# EAGLE design PCE_Trace_Power_test (EAGLE 9.6.2)
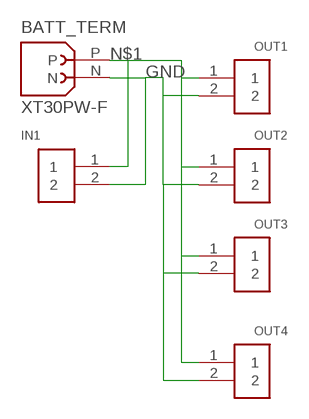
[diagram p0: schematic, sheet 1]

## Parts
BATT_TERM  XT30PW-F  [AMASS_XT30PW-F]
IN1  282837-2  [TE_282837-2]
OUT1  282837-2  [TE_282837-2]
OUT2  282837-2  [TE_282837-2]
OUT3  282837-2  [TE_282837-2]
OUT4  282837-2  [TE_282837-2]

## Nets
GND: BATT_TERM.N IN1.2 OUT1.2 OUT2.2 OUT3.2 OUT4.2
N$1: BATT_TERM.P IN1.1 OUT1.1 OUT2.1 OUT3.1 OUT4.1

## Library data of the parts
BATT_TERM = XT30PW-F:XT30PW-F: Check availability <https://pricing.snapeda.com/parts/XT30PW-F/amass/view-part?ref=eda>; AVAILABILITY: Not in stock; CHECK_PRICES: https://www.snapeda.com/parts/XT30PW-F/AMASS/view-part/?ref=eda; DESCRIPTION: Socket; DC supply; XT30; female; PIN: 2; on PCBs; THT; yellow; 15A; MF: amass; MP: XT30PW-F; PACKAGE: None; PRICE: None; SNAPEDA_LINK: https://www.snapeda.com/parts/XT30PW-F/AMASS/view-part/?ref=snap
IN1 OUT1-OUT4 = 282837-2:282837-2: TERM BLOCK 5.08MM 2POS SIDE ENTY Check availability <https://pricing.snapeda.com/parts/282837-2/TE%20Connectivity/view-part?ref=eda>; AVAILABILITY: In Stock; CHECK_PRICES: https://www.snapeda.com/parts/282837-2/TE+Connectivity+AMP+Connectors/view-part/?ref=eda; COMMENT: 282837-2; DESCRIPTION: Terminal Block Connector Wire Receptacle 2 5.08 mm 30-16 AWG Green 13.5 A 250 V | TE Connectivity 282837-2; MF: TE Connectivity; MP: 282837-2; PACKAGE: None; PRICE: None; PURCHASE-URL: https://www.snapeda.com/api/url_track_click_mouser/?unipart_id=2549980&manufacturer=TE Connectivity&part_name=282837-2&search_term=None; SNAPEDA_LINK: https://www.snapeda.com/parts/282837-2/TE+Connectivity+AMP+Connectors/view-part/?ref=snap

## Net classes
2 lowpower: width 0.254 mm, drill 0.483 mm

## Board
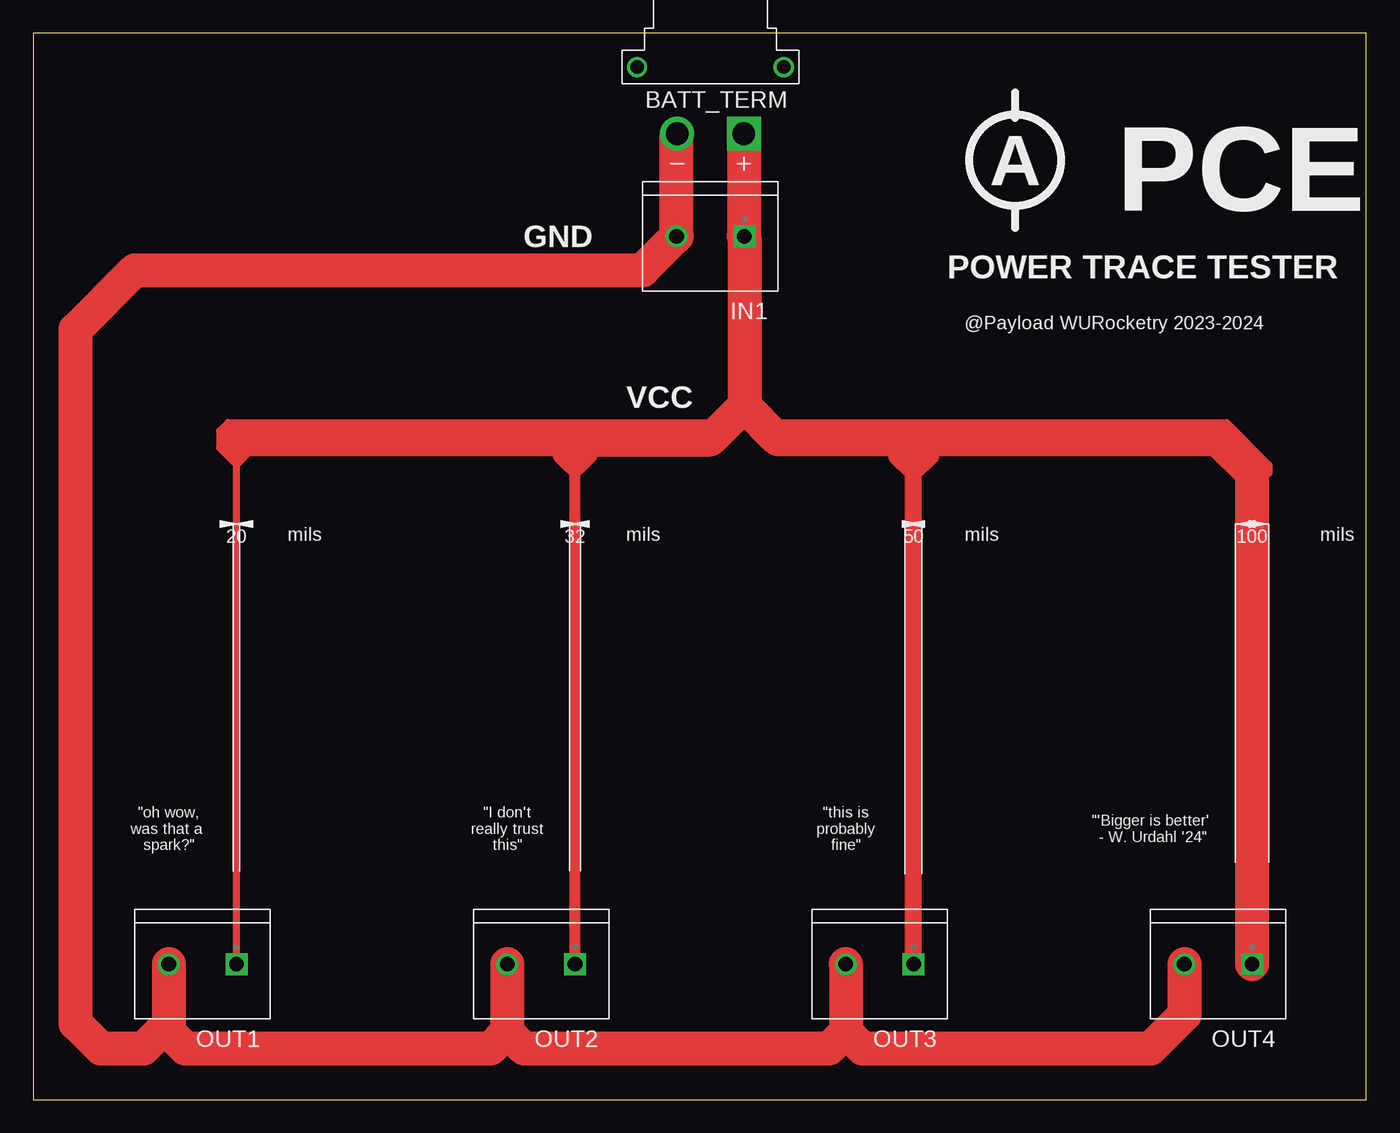
[diagram p1: board, top side]
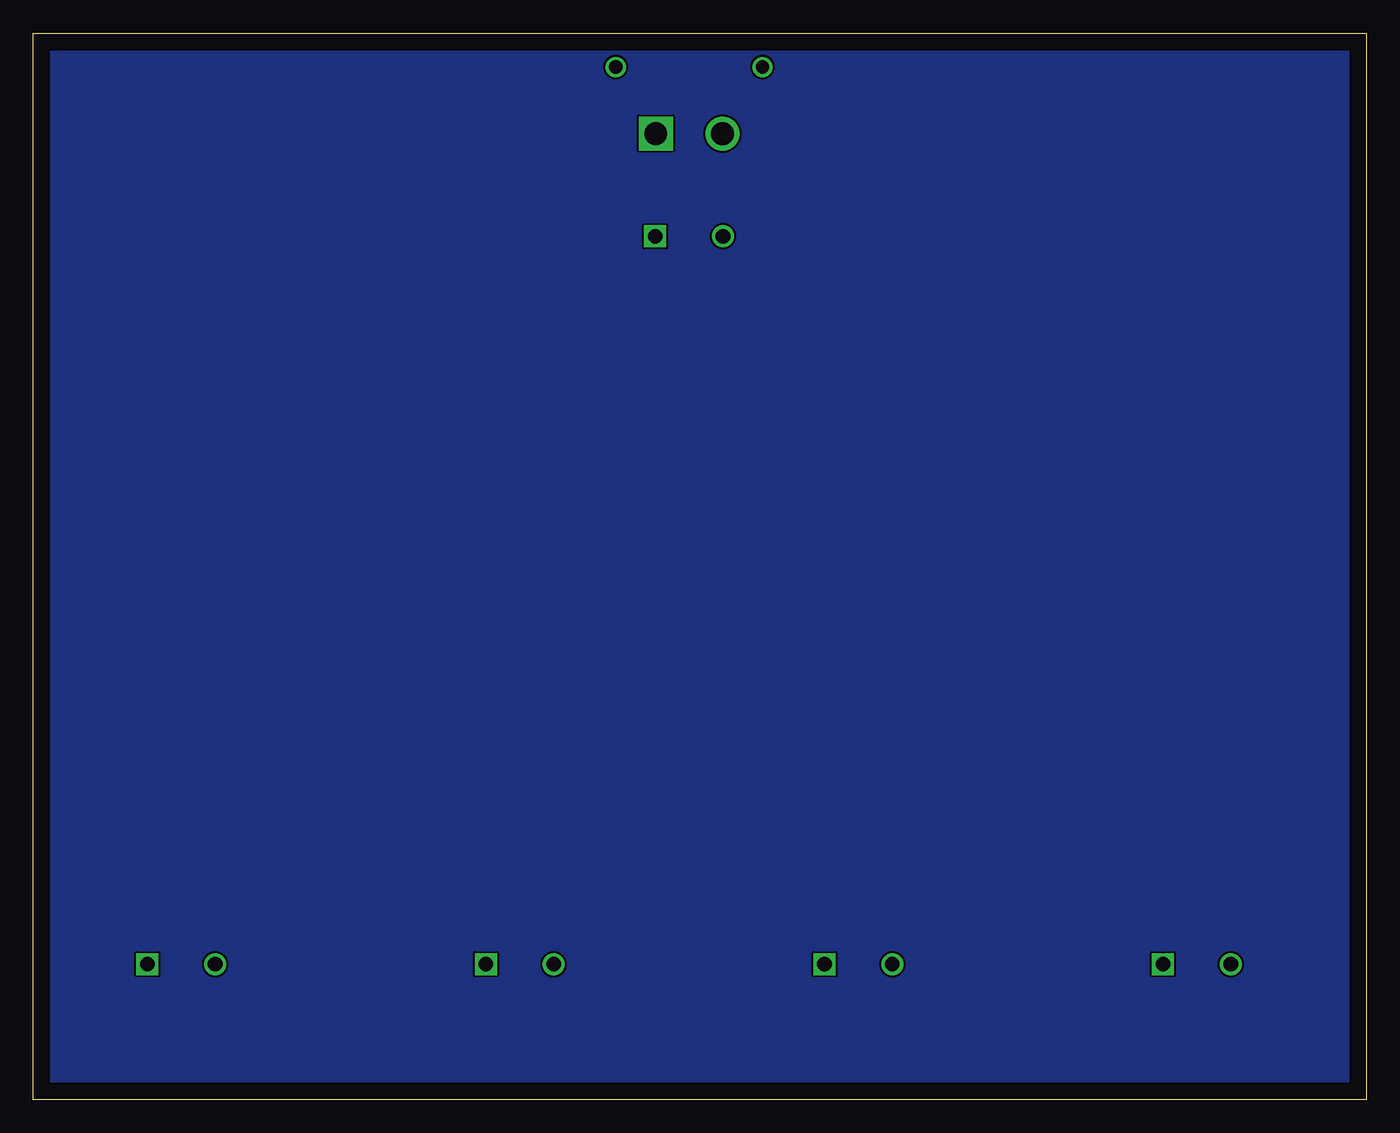
[diagram p2: board, bottom side, seen from below]

Size 100 x 80 mm. Coordinates in mm from the lower left corner, seen from the top.
Outline: 0,0 100,0 100,80 0,80 0,0
Copper layers (1*16): Top 0.035mm / dielectric 1.5mm / Bottom 0.035mm
Design rules "default *": minimum track width 6mil, minimum drill 0.35mm, track to track 6mil, track to pad 6mil, pad to pad 6mil, via to via 6mil, smd to smd 6mil, copper to edge 50mil, drill to drill 6mil, minimum pad ring 10mil, minimum via ring 8mil, stop-mask expansion 4mil, vias tented up to drill 0mil, thermal gap 10mil

### Footprints (pad centres in the part's own frame; a part is rotated, then mirrored left to right if it is on the bottom)
AMASS_XT30PW-F = drill 1.7: N -2.5,-5 | drill 1.7 square: P 2.5,-5 | drill 1: S1 5.5,0; S2 -5.5,0
TE_282837-2 = drill 1.1 square: 1 -2.54,0 | drill 1.1: 2 2.54,0

### Placement (x,y rotation side)
BATT_TERM  50.8,77.47 0 top
IN1  50.8,64.77 180 top
OUT1  12.7,10.16 180 top
OUT2  38.1,10.16 180 top
OUT3  63.5,10.16 180 top
OUT4  88.9,10.16 180 top

### Tracks (layer width: path | path; a pad name or v marks a point on that pad's centre or on a via)
GND
  Top 2.54: OUT4.2 86.36,6.35 83.82,3.81 62.23,3.81 60.96,5.08 | OUT3.2 60.96,5.08 | 60.96,5.08 59.69,3.81 36.83,3.81 35.56,5.08 | OUT2.2 35.56,5.08 | 35.56,5.08 34.29,3.81 11.43,3.81 10.16,5.08 | OUT1.2 10.16,5.08 | 10.16,5.08 9.53,5.08 8.26,3.81 5.08,3.81 3.17,5.71 3.17,57.78 7.62,62.23 45.72,62.23 IN1.2 48.26,72.43 BATT_TERM.N
N$1
  Top 0.508: OUT1.1 15.24,47.62 | 92.08,46.35 92.71,46.99 92.71,47.62 89.53,50.8 14.61,50.8 13.97,50.16 13.97,48.9 14.61,48.26 | 14.61,48.26 15.24,47.62 | 15.24,47.62 15.24,48.26 | 14.61,48.26 15.24,48.26 | 15.24,47.62 16.51,48.9 | 15.24,49.53 15.24,48.26
  Top 0.813: 40.64,46.99 OUT2.1 40.64,49.53 | 40.01,47.62 39.37,48.26 41.91,48.26 41.27,47.62 | 40.64,46.99 40.01,47.62 | 41.27,47.62 40.64,46.99 | 40.01,47.62 41.27,47.62
  Top 1.27: 66.04,46.99 OUT3.1 66.04,49.53 | 66.04,46.99 64.77,48.26 67.31,48.26 66.04,46.99
  Top 2.54: 53.34,52.07 50.8,49.53 40.64,49.53 15.24,49.53 | 53.34,52.07 55.88,49.53 66.04,49.53 88.9,49.53 91.44,46.99 OUT4.1 | BATT_TERM.P 53.3,64.81 IN1.1 53.34,52.07
THRM
  pour Bottom: 0,80.01 0,0 100.33,0 100.33,80.01

### Text on the board
tPlace: A | PCE | GND | POWER TRACE TESTER | @Payload WURocketry 2023-2024 | VCC | mils | mils | mils | mils | "oh wow, / was that a / spark?" | "I don't / really trust / this" | "this is / probably / fine" | "'Bigger is better' / - W. Urdahl '24"